# EAGLE design Vision Impaired Arduino Board (EAGLE 9.6.2)
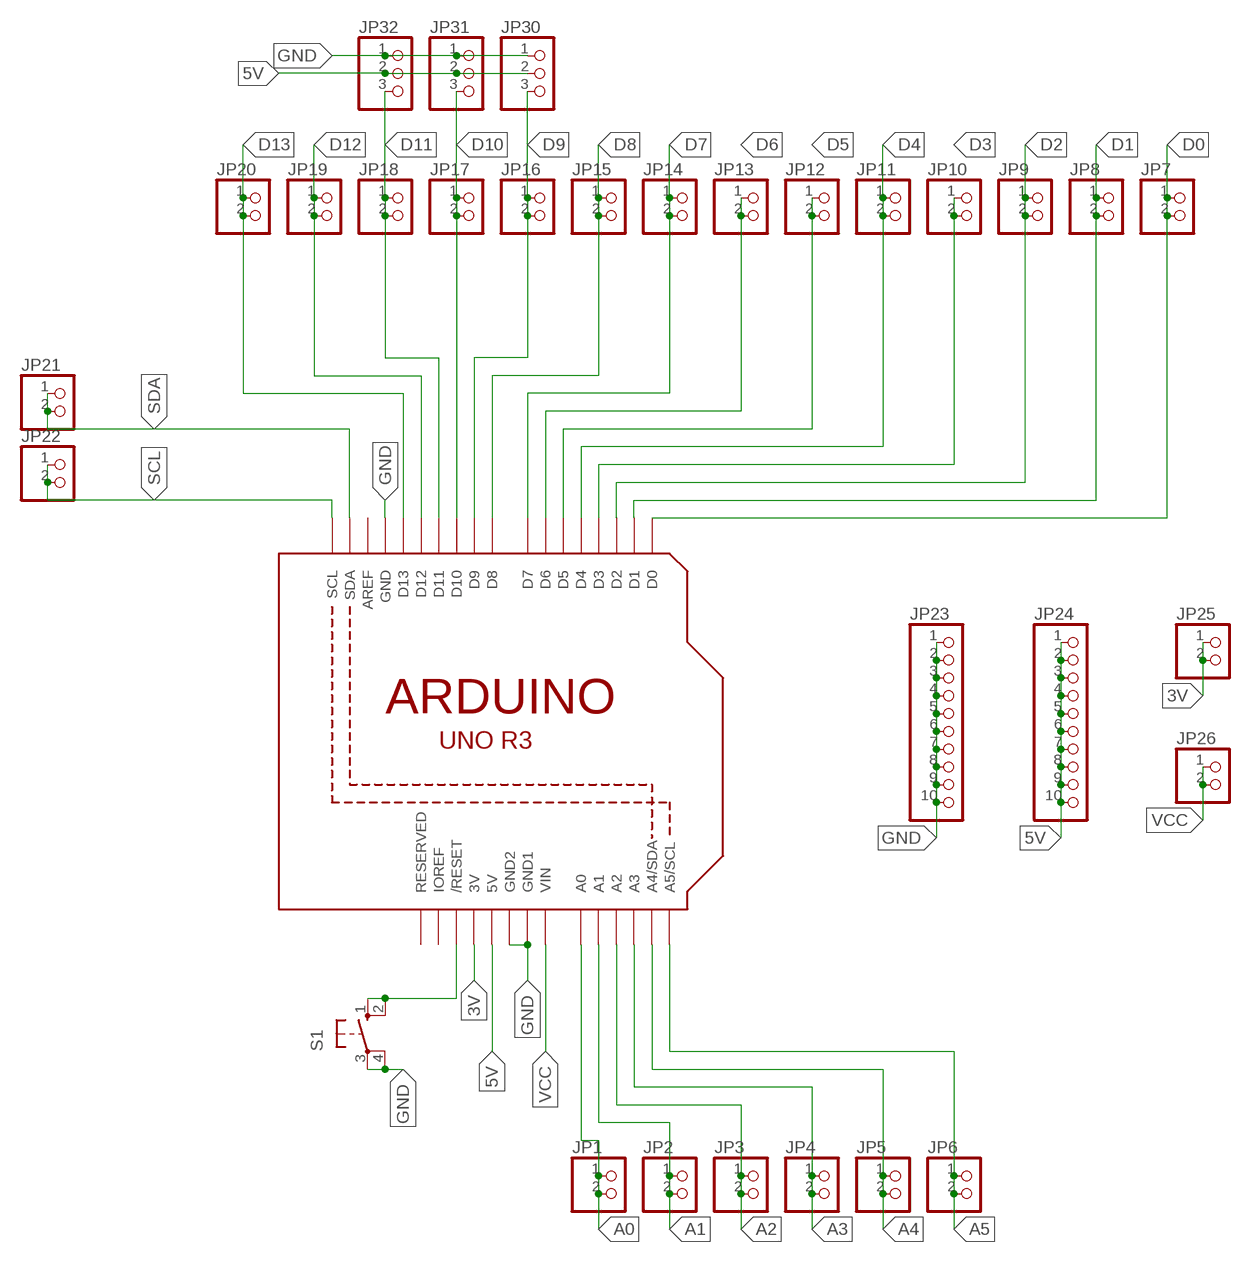
[diagram p0: schematic, sheet 1]

## Parts
JP1  PINHD-1X2  [1X02]
JP2  PINHD-1X2  [1X02]
JP3  PINHD-1X2  [1X02]
JP4  PINHD-1X2  [1X02]
JP5  PINHD-1X2  [1X02]
JP6  PINHD-1X2  [1X02]
JP7  PINHD-1X2  [1X02]
JP8  PINHD-1X2  [1X02]
JP9  PINHD-1X2  [1X02]
JP10  PINHD-1X2  [1X02]
JP11  PINHD-1X2  [1X02]
JP12  PINHD-1X2  [1X02]
JP13  PINHD-1X2  [1X02]
JP14  PINHD-1X2  [1X02]
JP15  PINHD-1X2  [1X02]
JP16  PINHD-1X2  [1X02]
JP17  PINHD-1X2  [1X02]
JP18  PINHD-1X2  [1X02]
JP19  PINHD-1X2  [1X02]
JP20  PINHD-1X2  [1X02]
JP21  PINHD-1X2  [1X02]
JP22  PINHD-1X2  [1X02]
JP23  PINHD-1X10  [1X10]
JP24  PINHD-1X10  [1X10]
JP25  PINHD-1X2  [1X02]
JP26  PINHD-1X2  [1X02]
JP30  PINHD-1X3  [1X03]
JP31  PINHD-1X3  [1X03]
JP32  PINHD-1X3  [1X03]
S1  40-XX  [B3F-40XX]
U1  ARDUINOR3-BPLACE  [ARDUINOR3-BPLACE]

## Nets
3V: JP25.1 JP25.2 U1.3V
5V: JP24.1 JP24.2 JP24.3 JP24.4 JP24.5 JP24.6 JP24.7 JP24.8 JP24.9 JP24.10 JP30.2 JP31.2 JP32.2 U1.5V
A0: JP1.1 JP1.2 U1.A0
A1: JP2.1 JP2.2 U1.A1
A2: JP3.1 JP3.2 U1.A2
A3: JP4.1 JP4.2 U1.A3
A4: JP5.1 JP5.2 U1.A4(A4/SDA)
A5: JP6.1 JP6.2 U1.A5(A5/SCL)
D0: JP7.1 JP7.2 U1.D0
D1: JP8.1 JP8.2 U1.D1
D2: JP9.1 JP9.2 U1.D2
D3: JP10.1 JP10.2 U1.D3
D4: JP11.1 JP11.2 U1.D4
D5: JP12.1 JP12.2 U1.D5
D6: JP13.1 JP13.2 U1.D6
D7: JP14.1 JP14.2 U1.D7
D8: JP15.1 JP15.2 U1.D8
D9: JP16.1 JP16.2 JP30.3 U1.D9
D10: JP17.1 JP17.2 JP31.3 U1.D10
D11: JP18.1 JP18.2 JP32.3 U1.D11
D12: JP19.1 JP19.2 U1.D12
D13: JP20.1 JP20.2 U1.D13
GND: JP23.1 JP23.2 JP23.3 JP23.4 JP23.5 JP23.6 JP23.7 JP23.8 JP23.9 JP23.10 JP30.1 JP31.1 JP32.1 S1.3(P) S1.4(P1) U1.GND U1.GND1 U1.GND2
N$1: S1.1(S) S1.2(S1) U1.RESET(/RESET)
SCL: JP22.1 JP22.2 U1.SCL
SDA: JP21.1 JP21.2 U1.SDA
VCC: JP26.1 JP26.2 U1.VIN
Unconnected: U1.AREF U1.IOREF U1.RESERVED

## Library data of the parts
JP1-JP22 JP25 JP26 = pinhead:PINHD-1X2: PIN HEADER
JP23 JP24 = pinhead:PINHD-1X10: PIN HEADER
JP30-JP32 = pinhead:PINHD-1X3: PIN HEADER
S1 = adafruit:40-XX: OMRON SWITCH; MF: OMRON COMPONENTS USA; MPN: B3F-4000; OC_FARNELL: 176434; OC_NEWARK: 36K3105
U1 = adafruit:ARDUINOR3: This is a new object for the new Arduino R3 - with extra pins that you may want to use (such as IOref, and duplicated A4/A5

## Board
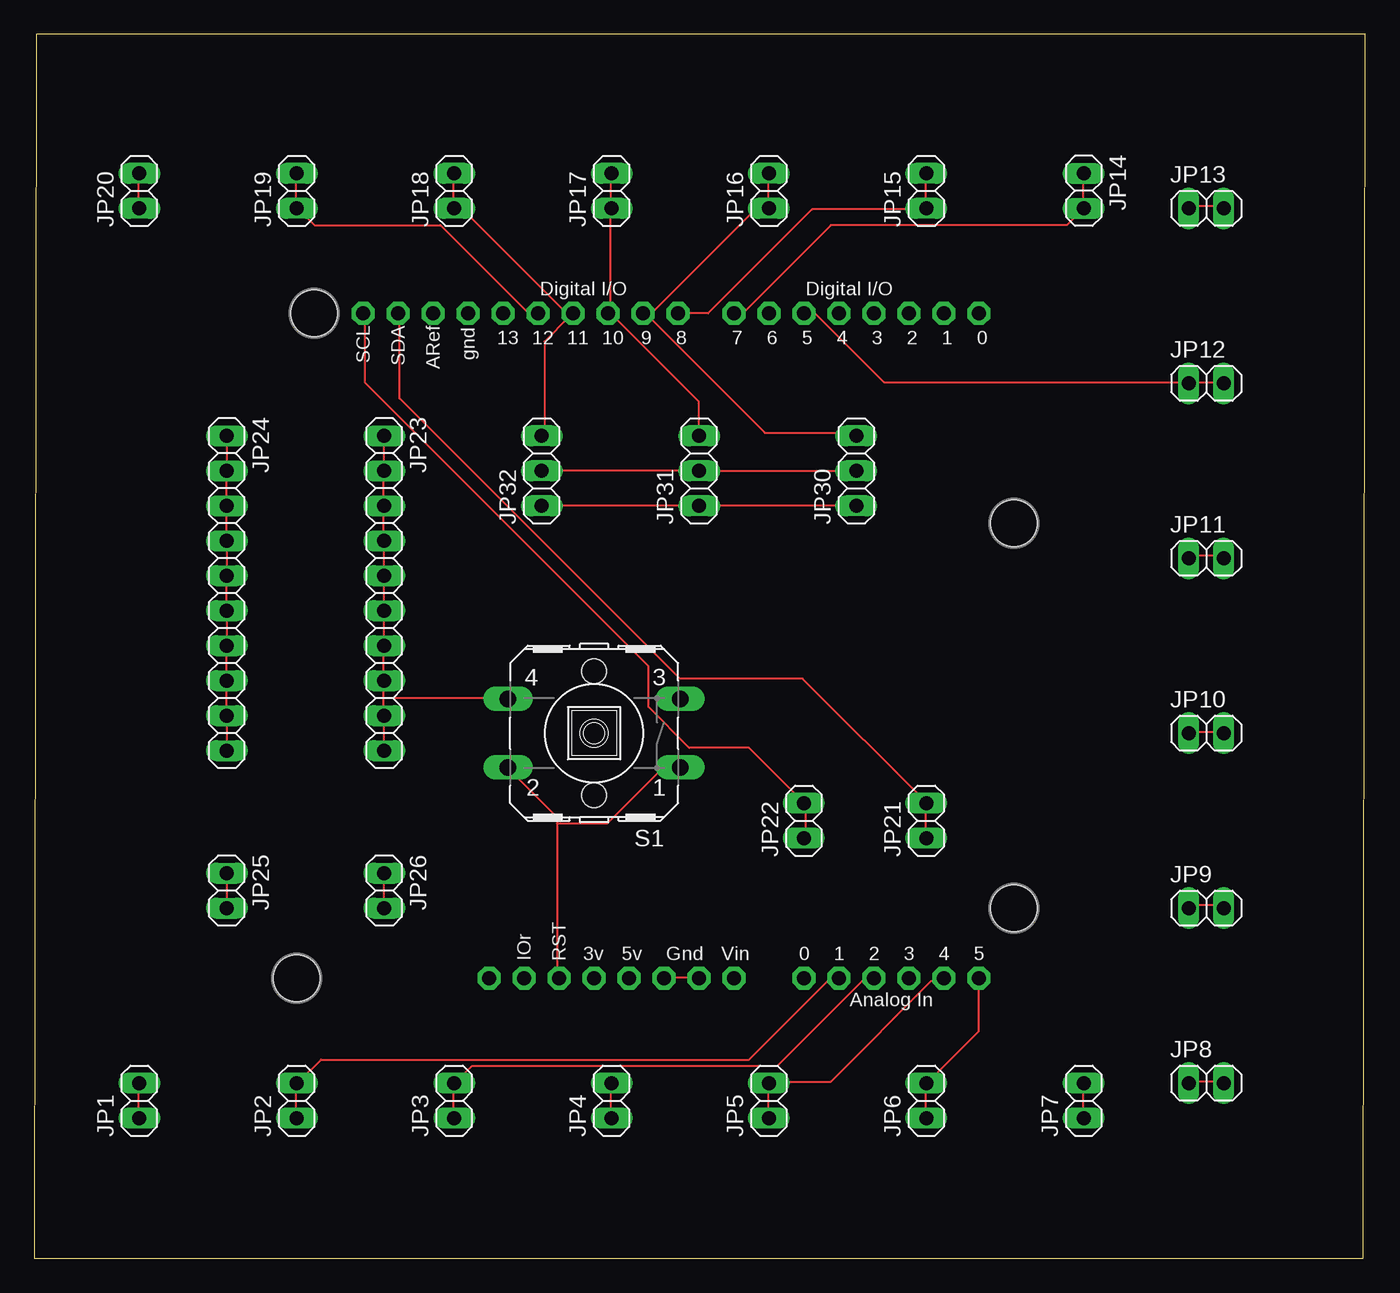
[diagram p1: board, top side]
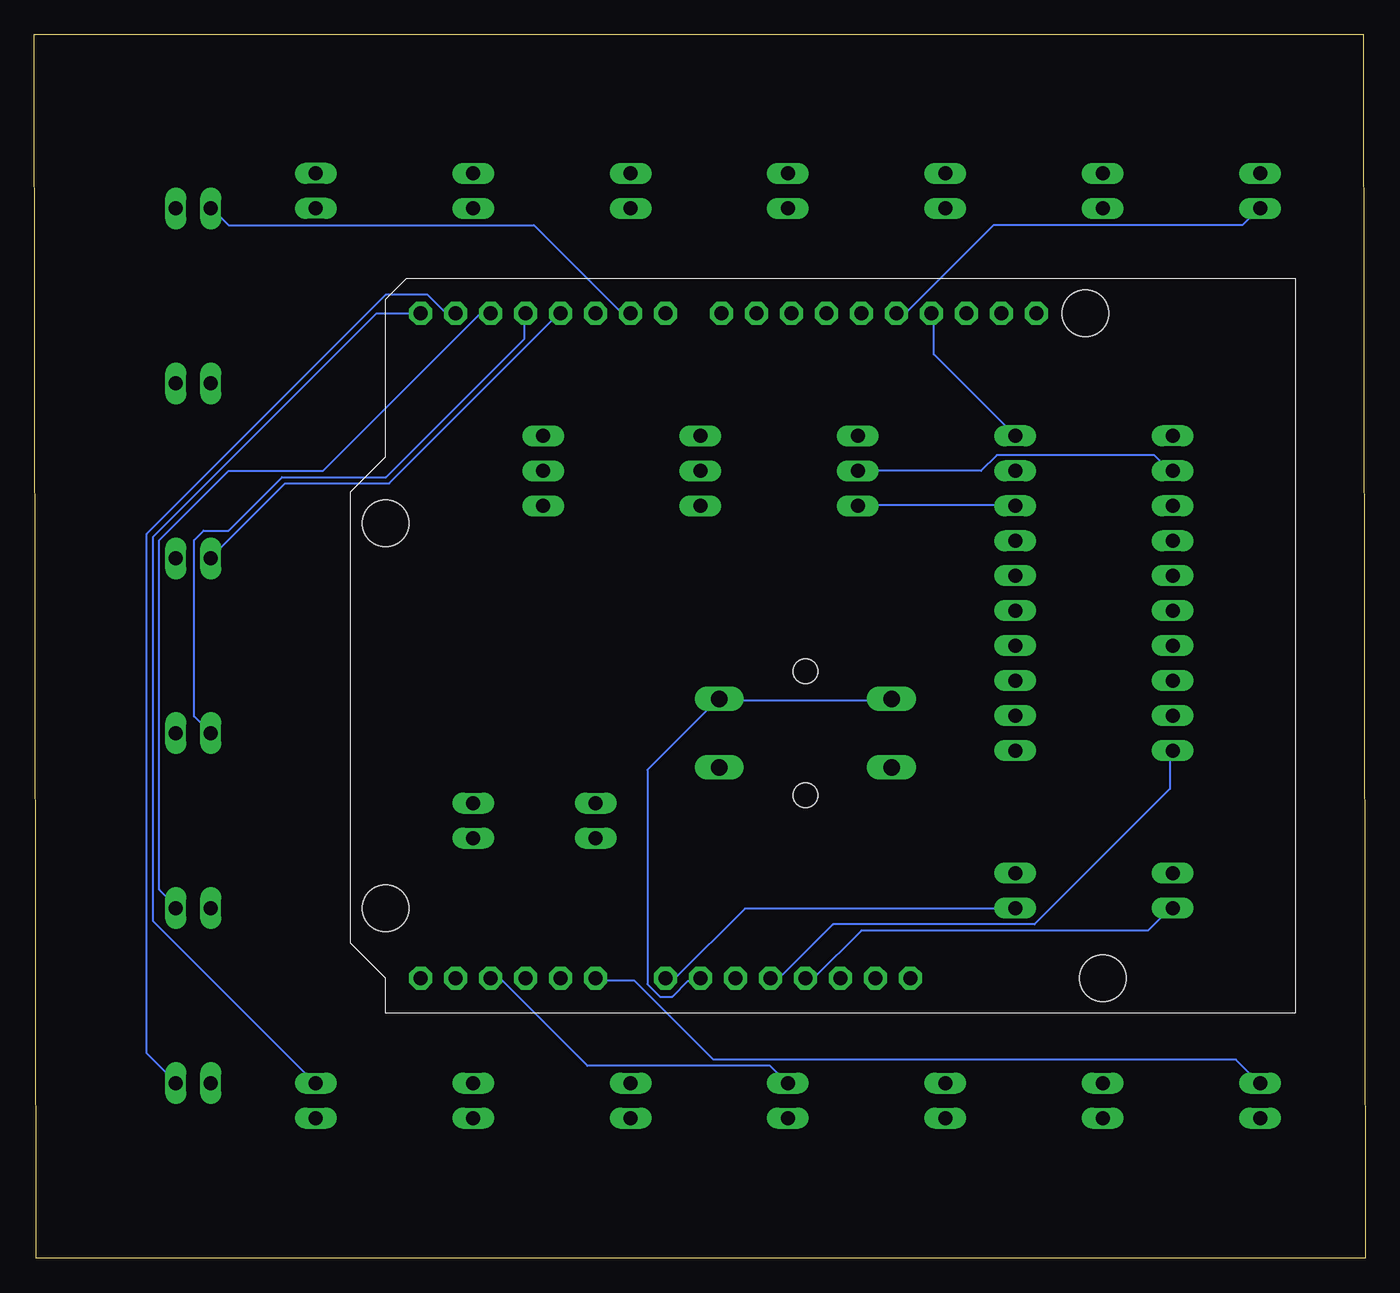
[diagram p2: board, bottom side, seen from below]

Size 96.63 x 88.82 mm. Coordinates in mm from the lower left corner, seen from the top.
Outline: 0,0 96.5,0 96.63,88.82 0.13,88.82 0,0
Copper layers (1*16): Top 0.035mm / dielectric 1.5mm / Bottom 0.035mm
Design rules "default *": minimum track width 6mil, minimum drill 0.35mm, track to track 12mil, track to pad 12mil, pad to pad 6mil, via to via 6mil, smd to smd 6mil, copper to edge 40mil, drill to drill 6mil, minimum pad ring 10mil, minimum via ring 8mil, stop-mask expansion 4mil, vias tented up to drill 0mil, thermal gap 10mil
Holes 3.4 mm at 20.32,68.58 71.12,53.34 71.12,25.4 19.05,20.32

### Footprints (pad centres in the part's own frame; a part is rotated, then mirrored left to right if it is on the bottom)
1X02 = drill 1.016 long: 1 -1.27,0; 2 1.27,0
1X10 = drill 1.016 long: 1 -11.43,0; 2 -8.89,0; 3 -6.35,0; 4 -3.81,0; 5 -1.27,0; 6 1.27,0; 7 3.81,0; 8 6.35,0; 9 8.89,0; 10 11.43,0
1X03 = drill 1.016 long: 1 -2.54,0; 2 0,0; 3 2.54,0
B3F-40XX = drill 1.194 long: 1 -6.248,2.489; 2 6.248,2.489; 3 -6.248,-2.489; 4 6.248,-2.489 | hole 1.803: 0,-4.496; 0,4.496
ARDUINOR3-BPLACE = drill 1 pad 1.676 octagon: 3V 35.56,2.54; 5V 38.1,2.54; A0 50.8,2.54; A1 53.34,2.54; A2 55.88,2.54; A3 58.42,2.54; A4 60.96,2.54; A5 63.5,2.54; AREF 23.876,50.8; D0 63.5,50.8; D1 60.96,50.8; D2 58.42,50.8; D3 55.88,50.8; D4 53.34,50.8; D5 50.8,50.8; D6 48.26,50.8; D7 45.72,50.8; D8 41.656,50.8; D9 39.116,50.8; D10 36.576,50.8; D11 34.036,50.8; D12 31.496,50.8; D13 28.956,50.8; GND 26.416,50.8; GND1 43.18,2.54; GND2 40.64,2.54; IOREF 30.48,2.54; RESERVED 27.94,2.54; RESET 33.02,2.54; SCL 18.796,50.8; SDA 21.336,50.8; VIN 45.72,2.54

### Placement (x,y rotation side)
JP1  7.62,11.43 90 top
JP2  19.05,11.43 90 top
JP3  30.48,11.43 90 top
JP4  41.91,11.43 90 top
JP5  53.34,11.43 90 top
JP6  64.77,11.43 90 top
JP7  76.2,11.43 90 top
JP8  85.09,12.7 0 top
JP9  85.09,25.4 0 top
JP10  85.09,38.1 0 top
JP11  85.09,50.8 0 top
JP12  85.09,63.5 0 top
JP13  85.09,76.2 0 top
JP14  76.2,77.47 270 top
JP15  64.77,77.47 90 top
JP16  53.34,77.47 90 top
JP17  41.91,77.47 90 top
JP18  30.48,77.47 90 top
JP19  19.05,77.47 90 top
JP20  7.62,77.47 90 top
JP21  64.77,31.75 90 top
JP22  55.88,31.75 90 top
JP23  25.4,48.26 270 top
JP24  13.97,48.26 270 top
JP25  13.97,26.67 270 top
JP26  25.4,26.67 270 top
JP30  59.69,57.15 90 top
JP31  48.26,57.15 90 top
JP32  36.83,57.15 90 top
S1  40.64,38.1 180 top
U1  5.08,17.78 0 top

### Tracks (layer width: path | path; a pad name or v marks a point on that pad's centre or on a via)
3V
  Top 0.152: JP25.2 13.95,25.6 13.95,27.89 JP25.1
  Bottom 0.152: U1.3V 40.46,20.34 40.01,20.34 36.58,23.77 15.77,23.77 14.17,25.38 JP25.2
5V
  Top 0.152: JP32.2 JP31.2 JP30.2 | 13.95,57.15 13.95,59.66 JP24.1 | 13.95,57.15 13.95,54.63 JP24.3 13.95,54.41 13.95,52.12 JP24.4 13.95,51.89 13.95,49.61 JP24.5 13.95,49.38 13.95,47.09 JP24.6 13.95,46.86 13.95,44.58 JP24.7 13.95,44.35 13.95,42.06 JP24.8 13.95,41.83 13.95,39.55 JP24.9 13.95,39.32 13.95,37.03 JP24.10 | 13.95,57.15 JP24.2
  Bottom 0.152: U1.5V 42.98,20.34 42.52,20.34 38.63,24.23 24,24.23 14.17,34.06 14.17,36.8 JP24.10 | JP32.2 27.89,57.15 26.75,58.29 15.32,58.29 14.17,57.15 JP24.2
A0
  Top 0.152: JP1.1 7.54,10.29 7.54,12.57 JP1.2
  Bottom 0.152: U1.A0 55.78,20.12 53.03,20.12 47.32,14.4 9.37,14.4 7.77,12.8 JP1.2
A1
  Top 0.152: JP2.1 18.97,10.29 18.97,12.57 JP2.2 19.2,12.8 20.8,14.4 51.89,14.4 57.61,20.12 58.29,20.12 U1.A1
A2
  Top 0.152: JP3.1 30.4,10.29 30.4,12.57 JP3.2 30.63,12.8 31.77,13.95 53.95,13.95 60.12,20.12 60.81,20.12 U1.A2
A3
  Top 0.152: JP4.1 41.83,10.29 41.83,12.57 JP4.2
  Bottom 0.152: U1.A3 63.32,20.12 62.64,20.12 56.46,13.95 43.2,13.95 42.06,12.8 JP4.2
A4
  Top 0.152: JP5.1 53.26,10.29 53.26,12.57 JP5.2 53.49,12.8 57.84,12.8 65.15,20.12 65.84,20.12 U1.A4
A5
  Top 0.152: JP6.1 64.69,10.29 64.69,12.57 JP6.2 64.92,12.8 68.58,16.46 U1.A5
D0
  Top 0.152: JP7.1 76.12,10.29 76.12,12.57 JP7.2
  Bottom 0.152: U1.D0 71.78,68.58 88.01,52.35 88.01,24.46 76.35,12.8 JP7.2
D1
  Top 0.152: JP8.1 83.9,12.8 86.18,12.8 JP8.2
  Bottom 0.152: U1.D1 66.75,68.58 68.12,69.95 71.09,69.95 88.47,52.58 88.47,14.86 86.41,12.8 JP8.2
D2
  Top 0.152: JP9.1 83.9,25.6 86.18,25.6 JP9.2
  Bottom 0.152: U1.D2 64.24,68.58 75.67,57.15 82.53,57.15 87.55,52.12 87.55,26.75 86.41,25.6 JP9.2
D3
  Top 0.152: JP10.1 83.9,38.18 86.18,38.18 JP10.2
  Bottom 0.152: JP10.1 85.04,39.32 85.04,52.12 84.35,52.81 82.53,52.81 78.64,56.69 71.09,56.69 61.04,66.75 61.04,68.58 U1.D3
D4
  Top 0.152: JP11.1 83.9,50.98 86.18,50.98 JP11.2
  Bottom 0.152: U1.D4 58.52,68.58 70.87,56.24 78.41,56.24 83.67,50.98 JP11.1
D5
  Top 0.152: JP12.2 86.18,63.55 83.9,63.55 JP12.1 83.67,63.55 61.72,63.55 56.69,68.58 U1.D5
D6
  Top 0.152: JP13.1 83.9,76.35 86.18,76.35 JP13.2
  Bottom 0.152: U1.D6 53.95,68.58 60.35,74.98 82.53,74.98 83.67,76.12 JP13.1
D7
  Top 0.152: JP14.1 76.12,78.64 76.12,76.35 JP14.2 74.98,74.98 57.84,74.98 51.44,68.58 U1.D7
D8
  Top 0.152: JP15.2 64.69,78.64 64.69,76.35 JP15.1 64.69,76.12 56.46,76.12 48.92,68.58 U1.D8
D9
  Top 0.152: JP16.2 53.26,78.64 53.26,76.35 JP16.1 53.26,76.12 52.35,76.12 44.58,68.35 | 44.58,68.35 44.35,68.58 U1.D9 44.58,68.35 | 44.58,68.35 53.03,59.89 59.66,59.89 JP30.3
D10
  Top 0.152: JP17.2 41.83,78.64 41.83,76.35 JP17.1 41.83,76.12 41.83,68.58 | 41.83,68.58 48.23,62.18 48.23,59.89 JP31.3 | 41.83,68.58 U1.D10
D11
  Top 0.152: JP18.2 30.4,78.64 30.4,76.35 JP18.1 30.63,76.12 31.09,76.12 38.86,68.35 | 38.86,68.35 39.09,68.58 U1.D11 38.86,68.35 | 38.86,68.35 37.03,66.52 37.03,59.89 JP32.3
D12
  Top 0.152: JP19.2 18.97,78.64 18.97,76.35 JP19.1 19.2,76.12 20.34,74.98 29.49,74.98 35.89,68.58 U1.D12
D13
  Top 0.152: JP20.1 7.54,76.35 7.54,78.64 JP20.2
  Bottom 0.152: U1.D13 33.38,68.58 26.98,74.98 8.91,74.98 7.77,76.12 JP20.1
GND
  Top 0.152: U1.GND2 45.72,20.34 48.23,20.34 U1.GND1 | JP23.10 25.38,37.03 25.38,39.32 JP23.9 25.38,39.55 25.38,40.69 | 25.38,40.69 25.38,41.83 JP23.8 25.38,42.06 25.38,44.35 JP23.7 25.38,44.58 25.38,46.86 JP23.6 25.38,47.09 25.38,49.38 JP23.5 25.38,49.61 25.38,51.89 JP23.4 25.38,52.12 25.38,54.41 JP23.3 25.38,54.63 25.38,57.15 | 25.38,40.69 34.29,40.69 S1.4 | 25.38,57.15 25.38,59.66 JP23.1 | JP32.1 37.03,54.63 48.23,54.63 JP31.1 48.46,54.63 59.66,54.63 JP30.1 | 25.38,57.15 JP23.2
  Bottom 0.152: S1.4 34.52,40.46 46.86,40.46 S1.3 47.09,40.46 52.12,35.43 52.12,19.89 51.21,18.97 50.29,18.97 49.15,20.12 48.46,20.12 U1.GND1 | JP23.1 31.32,65.61 31.32,68.58 U1.GND | JP32.1 36.8,54.63 25.6,54.63 JP23.3
N$1
  Top 0.152: 37.95,31.55 37.95,32 34.52,35.43 S1.2 | 37.95,31.55 37.95,20.34 U1.RESET | 37.95,31.55 41.6,31.55 45.49,35.43 46.86,35.43 S1.1
SCL
  Top 0.152: JP22.1 56.01,30.63 56.01,32.92 JP22.2 55.78,33.15 51.89,37.03 47.55,37.03 44.58,40.01 44.58,42.98 24,63.55 24,68.58 U1.SCL
SDA
  Top 0.152: JP21.1 64.69,30.63 64.69,32.92 JP21.2 64.69,33.15 55.78,42.06 46.86,42.06 26.52,62.41 26.52,68.58 U1.SDA
VCC
  Top 0.152: JP26.2 25.38,25.6 25.38,27.89 JP26.1
  Bottom 0.152: U1.VIN 50.75,20.34 50.06,20.34 45.03,25.38 25.6,25.38 JP26.2

### Text on the board
tValues: ~ | ~ | ~ | 13 | 12 | 11 | 10 | D9 | D8 | D7 | D6 | ~ | 11 | 10 | 9 | D5 | ~ | 5V | GND | D4 | Servo Inputs | 5 VOLT | GROUND | D3 | ~ | RESET | 3V | VIN | SCL | SDA | D2 | D1 | A0 | A1 | A2 | A3 | A4 | A5 | D0